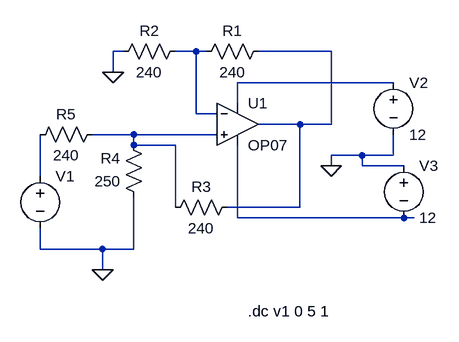
[diagram p0: schematic VI_Converter.asc]
VI_Converter.asc, the LTspice schematic file:
Version 4
SHEET 1 880 680
WIRE 0 32 -16 32
WIRE 112 32 80 32
WIRE 128 32 112 32
WIRE 320 32 208 32
WIRE -16 64 -16 32
WIRE 416 80 176 80
WIRE 176 112 176 80
WIRE 112 128 112 32
WIRE 144 128 112 128
WIRE 272 144 208 144
WIRE 320 144 320 32
WIRE 320 144 272 144
WIRE 16 160 -48 160
WIRE 144 160 16 160
WIRE 16 176 16 160
WIRE 80 176 16 176
WIRE 368 192 320 192
WIRE 416 192 416 160
WIRE 416 192 368 192
WIRE 320 208 320 192
WIRE 368 208 368 192
WIRE 432 208 368 208
WIRE -128 224 -128 160
WIRE 80 272 80 176
WIRE 272 272 272 144
WIRE 272 272 160 272
WIRE 176 288 176 176
WIRE 432 288 176 288
WIRE 448 288 432 288
WIRE -128 336 -128 304
WIRE -32 336 -128 336
WIRE 16 336 16 256
WIRE 16 336 -32 336
WIRE -32 368 -32 336
FLAG -32 368 0
FLAG -16 64 0
FLAG 320 208 0
SYMBOL Opamps\\OP07 176 80 R0
SYMATTR InstName U1
SYMBOL res 224 16 R90
WINDOW 0 0 56 VBottom 2
WINDOW 3 32 56 VTop 2
SYMATTR InstName R1
SYMATTR Value 240
SYMBOL res 96 16 R90
WINDOW 0 0 56 VBottom 2
WINDOW 3 32 56 VTop 2
SYMATTR InstName R2
SYMATTR Value 240
SYMBOL res 32 272 R180
WINDOW 0 36 76 Left 2
WINDOW 3 36 40 Left 2
SYMATTR InstName R4
SYMATTR Value 250
SYMBOL res -144 176 R270
WINDOW 0 32 56 VTop 2
WINDOW 3 0 56 VBottom 2
SYMATTR InstName R5
SYMATTR Value 240
SYMBOL voltage -128 208 R0
WINDOW 123 0 0 Left 2
WINDOW 39 0 0 Left 2
SYMATTR InstName V1
SYMATTR Value ""
SYMBOL voltage 416 64 R0
WINDOW 123 0 0 Left 2
WINDOW 39 0 0 Left 2
SYMATTR InstName V2
SYMATTR Value 12
SYMBOL voltage 432 192 R0
WINDOW 123 0 0 Left 2
WINDOW 39 0 0 Left 2
SYMATTR InstName V3
SYMATTR Value 12
SYMBOL res 176 256 R90
WINDOW 0 0 56 VBottom 2
WINDOW 3 32 56 VTop 2
SYMATTR InstName R3
SYMATTR Value 240
TEXT 192 432 Left 2 !.dc v1 0 5 1

The netlist it stands for:
* VI_Converter.asc
XU1 N004 N001 N003 N006 N002 LT1001  ; OP07, pins In+ In- V+ V- OUT
R1 N002 N001 240
R2 N001 0 240
R4 0 N004 250
R5 N005 N004 240
V1 N005 0
V2 N003 0 12
V3 0 N006 12
R3 N002 N004 240
.dc v1 0 5 1
.lib LTC.lib
.backanno
.end